# EAGLE schematic power_module (EAGLE 8.6.3)
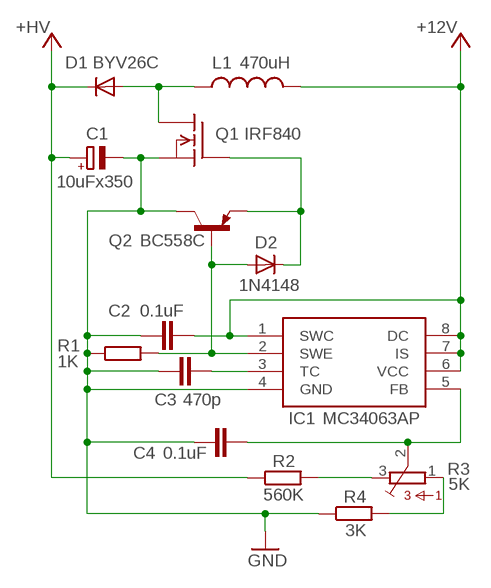
[diagram p0: schematic, sheet 1]

## Parts
C1  10uFx350  CPOL-EUE5-10.5  [E5-10,5]
C2  0.1uF  C-EU102-043X133  [C102-043X133]
C3  470p  C-EU050-035X075  [C050-035X075]
C4  0.1uF  C-EU102-043X133  [C102-043X133]
D1  BYV26C  BYV27  [SOD57-10]
D2  1N4148  1N4148DO35-10  [DO35-10]
IC1  MC34063AP  [DIL08]
L1  470uH  L-US6000-XXX-RC  [6000-XXXX-RC]
Q1  IRF840  [TO220]
Q2  BC558C  [TO92-EBC]
R1  1K  R-EU_0207/10  [0207/10]
R2  560K  R-EU_0207/10  [0207/10]
R3  5K  3362P  [3362P]
R4  3K  R-EU_0207/10  [0207/10]

## Nets
+5V: C2.2 IC1.1(SWC) IC1.6(VCC) IC1.7(IS) IC1.8(DC) L1.2 ; supply symbol labelled +12V
GND: C1.- C2.1 C3.1 C4.1 IC1.4(GND) Q1.3(S) Q2.C R1.1 R4.1
N$1: D2.C Q1.1(G) Q2.E
N$3: D2.A IC1.2(SWE) Q2.B R1.2
N$4: C3.2 IC1.3(TC)
N$5: C4.2 IC1.5(FB) R3.2
N$6: R3.1 R4.2
N$7: R2.2 R3.3
N$10: D1.A L1.1 Q1.2(D)
VCC: C1.+ D1.C R2.1 ; supply symbol labelled +HV

## Library data of the parts
C1 = rcl:CPOL-EU: POLARIZED CAPACITOR, European symbol; SPICEPREFIX: C
C2-C4 = rcl:C-EU: CAPACITOR, European symbol; SPICEPREFIX: C
D1 = diode:BYV27: DIODE ultra fast
D2 = diode:1N4148: DIODE high speed (Philips)
IC1 = mc34063:MC34063
L1 = rcl:L-US: INDUCTOR, American symbol; SPICEPREFIX: L
Q1 = transistor-fet:IRF840: N-Channel Enhancement MOSFET (HEXFET); 500V; 8A; 0,85Ohm
Q2 = transistor-pnp:BC558*: PNP Transistror
R1 R2 R4 = rcl:R-EU_: RESISTOR, European symbol; SPICEPREFIX: R
R3 = bourns:3362: 3362 Series 1/4" Square Trimmer